# EAGLE design gpio8p5 (EAGLE 7.2.0)
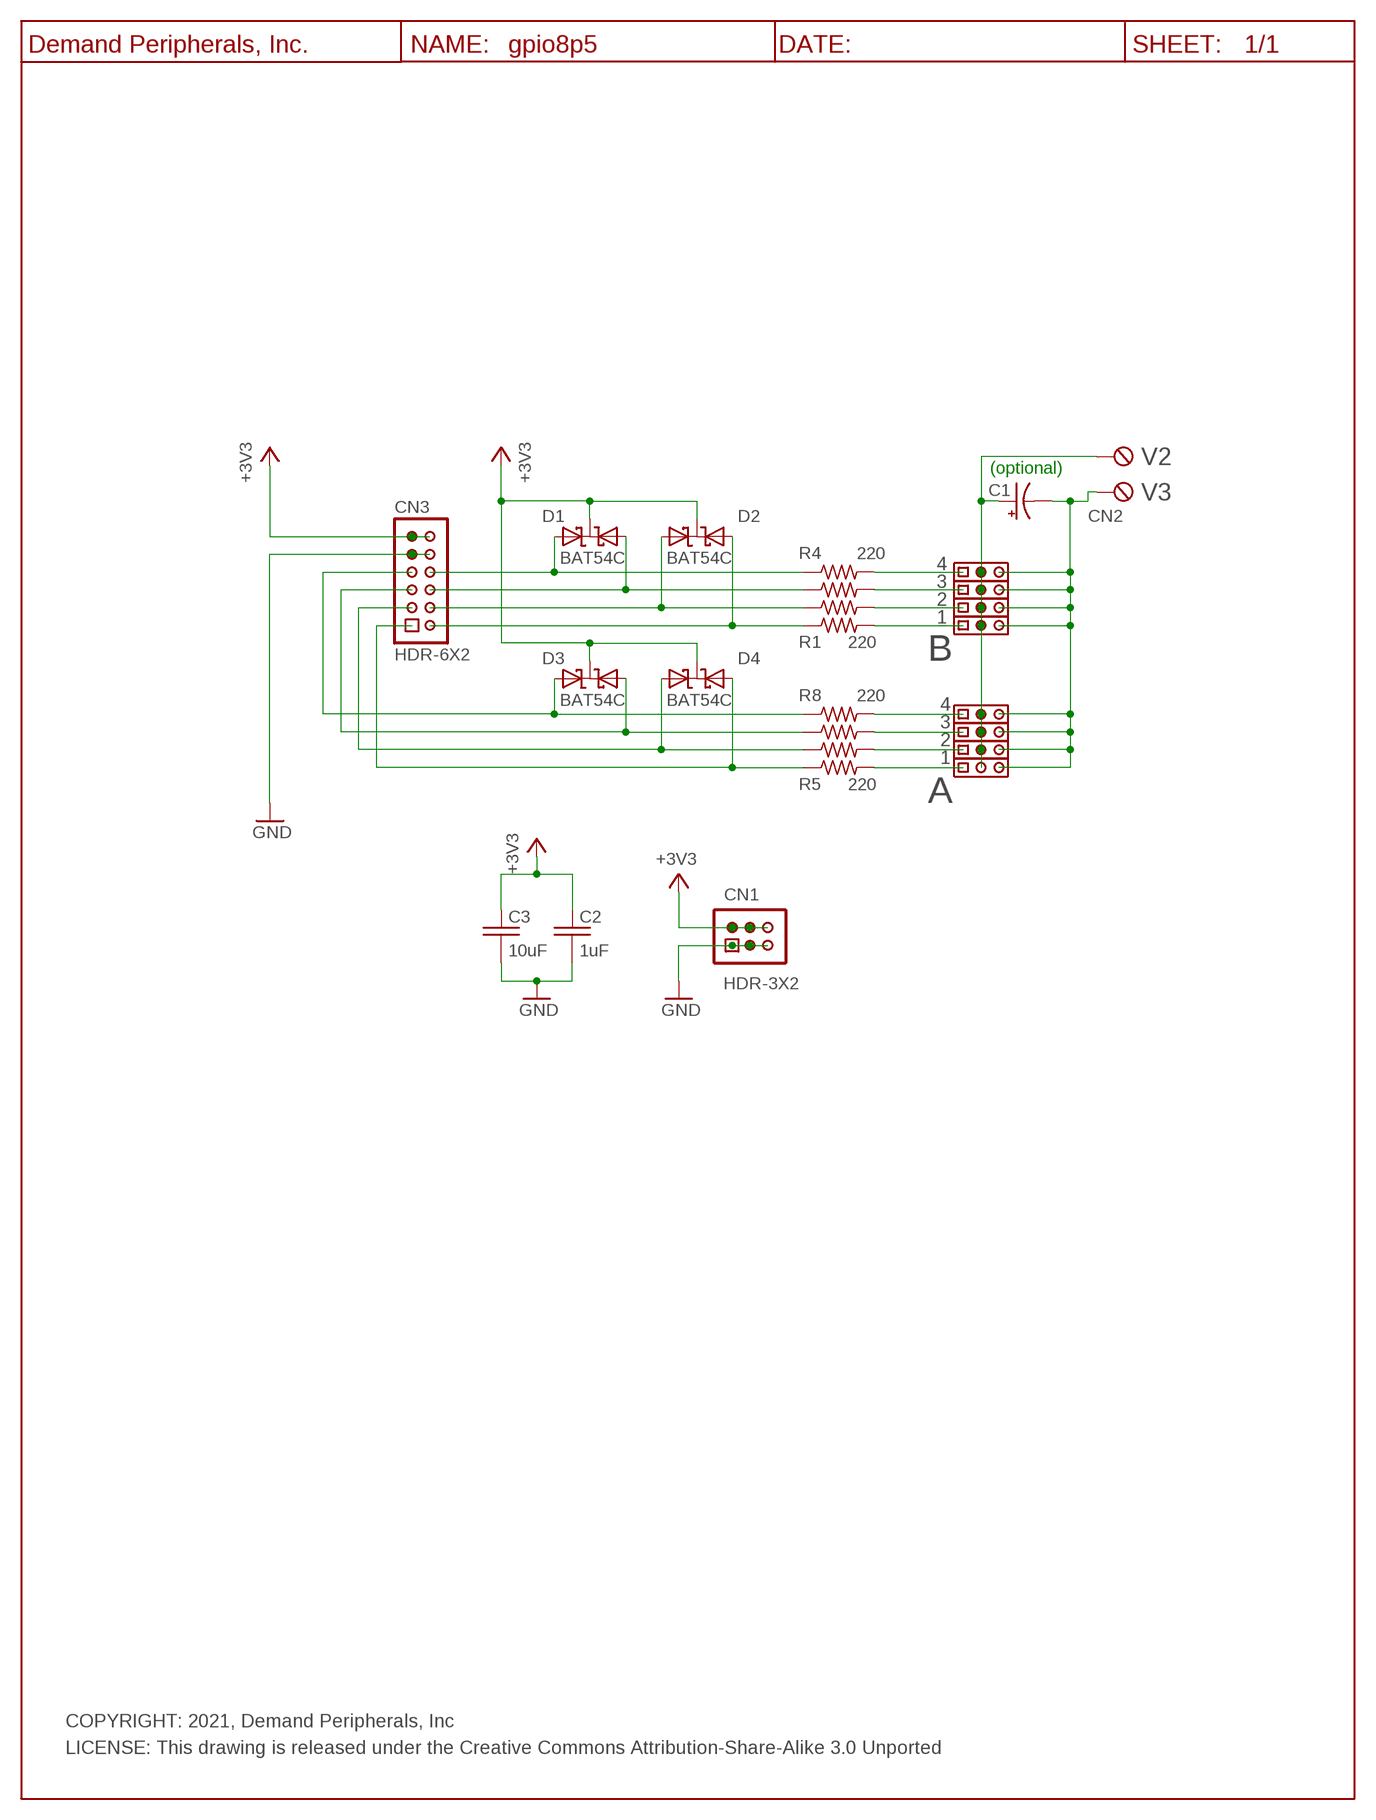
[diagram p0: schematic, sheet 1]

## Parts
C1  100uF  C100UF_E3.5-8  [E3.5-8]
C2  1uF  C1.0UF_C0603  [C0603]
C3  10uF  C10UF25V_C1206  [C1206]
CN1  HDR-3X2  [HDR-3X2]
CN2  TBLK-5.08-X2  [TBLK-5.08-X2]
CN3  HDR-6X2  [HDR-6X2]
D1  BAT54C  [SOT23]
D2  BAT54C  [SOT23]
D3  BAT54C  [SOT23]
D4  BAT54C  [SOT23]
R1  220  R220_R0603  [R0603]
R2  220  R220_R0603  [R0603]
R3  220  R220_R0603  [R0603]
R4  220  R220_R0603  [R0603]
R5  220  R220_R0603  [R0603]
R6  220  R220_R0603  [R0603]
R7  220  R220_R0603  [R0603]
R8  220  R220_R0603  [R0603]
U$1  DP_FRAME_P  [P_FRAME]
U$5  HDR-3X1  [HDR-3X1]
U$6  HDR-3X1  [HDR-3X1]
U$7  HDR-3X1  [HDR-3X1]
U$9  HDR-3X1  [HDR-3X1]
U$10  HDR-3X1  [HDR-3X1]
U$11  HDR-3X1  [HDR-3X1]
U$12  HDR-3X1  [HDR-3X1]
U$13  HDR-3X1  [HDR-3X1]

## Nets
+3V3: C2.1 C3.1 CN1.2 CN1.4 CN1.6 CN3.11 CN3.12 D1.3(CC) D2.3(CC) D3.3(CC) D4.3(CC)
GND: C2.2 C3.2 CN1.1 CN1.3 CN1.5 CN3.9 CN3.10
N$1: R4.2 U$5.1
N$2: R3.2 U$6.1
N$3: R2.2 U$7.1
N$4: R1.2 U$9.1
N$7: C1.- CN2.1(KL) U$5.3 U$6.3 U$7.3 U$9.3 U$10.3 U$11.3 U$12.3 U$13.3
N$8: CN3.7 D3.1(A1) R8.1
N$9: CN3.5 D3.2(A) R7.1
N$10: CN3.3 D4.1(A1) R6.1
N$11: CN3.8 D1.1(A1) R4.1
N$12: CN3.6 D1.2(A) R3.1
N$13: CN3.1 D4.2(A) R5.1
N$14: CN3.4 D2.1(A1) R2.1
N$15: CN3.2 D2.2(A) R1.1
N$16: R8.2 U$10.1
N$17: R7.2 U$11.1
N$18: C1.+ CN2.2(KL1) U$5.2 U$6.2 U$7.2 U$9.2 U$10.2 U$11.2 U$12.2 U$13.2
N$19: R6.2 U$12.1
N$20: R5.2 U$13.1

## Notes on the sheet
- V2
- (optional)
- V3
- 4
- 3
- 2
- 1
- B
- 4
- 3
- 2
- 1
- A
- COPYRIGHT: 2021, Demand Peripherals, Inc
- LICENSE: This drawing is released under the Creative Commons Attribution-Share-Alike 3.0 Unported

## Library data of the parts
C1 = dpi-passive:C100UF_: 100uF polarized capacitor, general purpose; VENDOR: Digikey; VENDOR-PART-NUM: 1572-1044-ND
C2 = dpi-passive:C1.0UF_: 1.0 uF Capacitor, 25V, Y5V; VENDOR: Digikey; VENDOR-PART-NUM: 490-3897-2-ND
C3 = dpi-passive:C10UF25V_: 10 uF Capacitor, 25V, X7R; VENDOR: Digikey; VENDOR-PART-NUM: 1276-1804-2-ND
CN1 = dpi-conn:HDR-3X2: Unshrouded 3x2 header with 0.1 inch pitch; VENDOR: Digikey; VENDOR-PART-NUM: 952-2120-ND
CN2 = dpi-conn:TBLK-5.08-X2: Terminal Block, 5.08mm, x2, screw terminals; VENDOR: Digikey; VENDOR-PART-NUM: ED2609-ND
CN3 = dpi-conn:HDR-6X2: Right angle 6x2 header
D1-D4 = dpi-diopto:BAT54C: BAT54C Dual Common Cathode Schottky; VENDOR: Digikey; VENDOR-PART-NUM: DB3X313N0LCT-ND
R1-R8 = dpi-passive:R220_: 220 Ohm resistor, 1%, 0.1 watt; VENDOR: Digikey; VENDOR-PART-NUM: 311-220HRTR-ND
U$1 = dpi-sym:DP_FRAME_P: Portrait/Letter Document Frame
U$5-U$7 U$9-U$13 = dpi-conn:HDR-3X1: 3 pin header on 0.1 inch centers, no shroud, no lock; VENDOR: Digikey; VENDOR-PART-NUM: 952-2264-ND

## Board
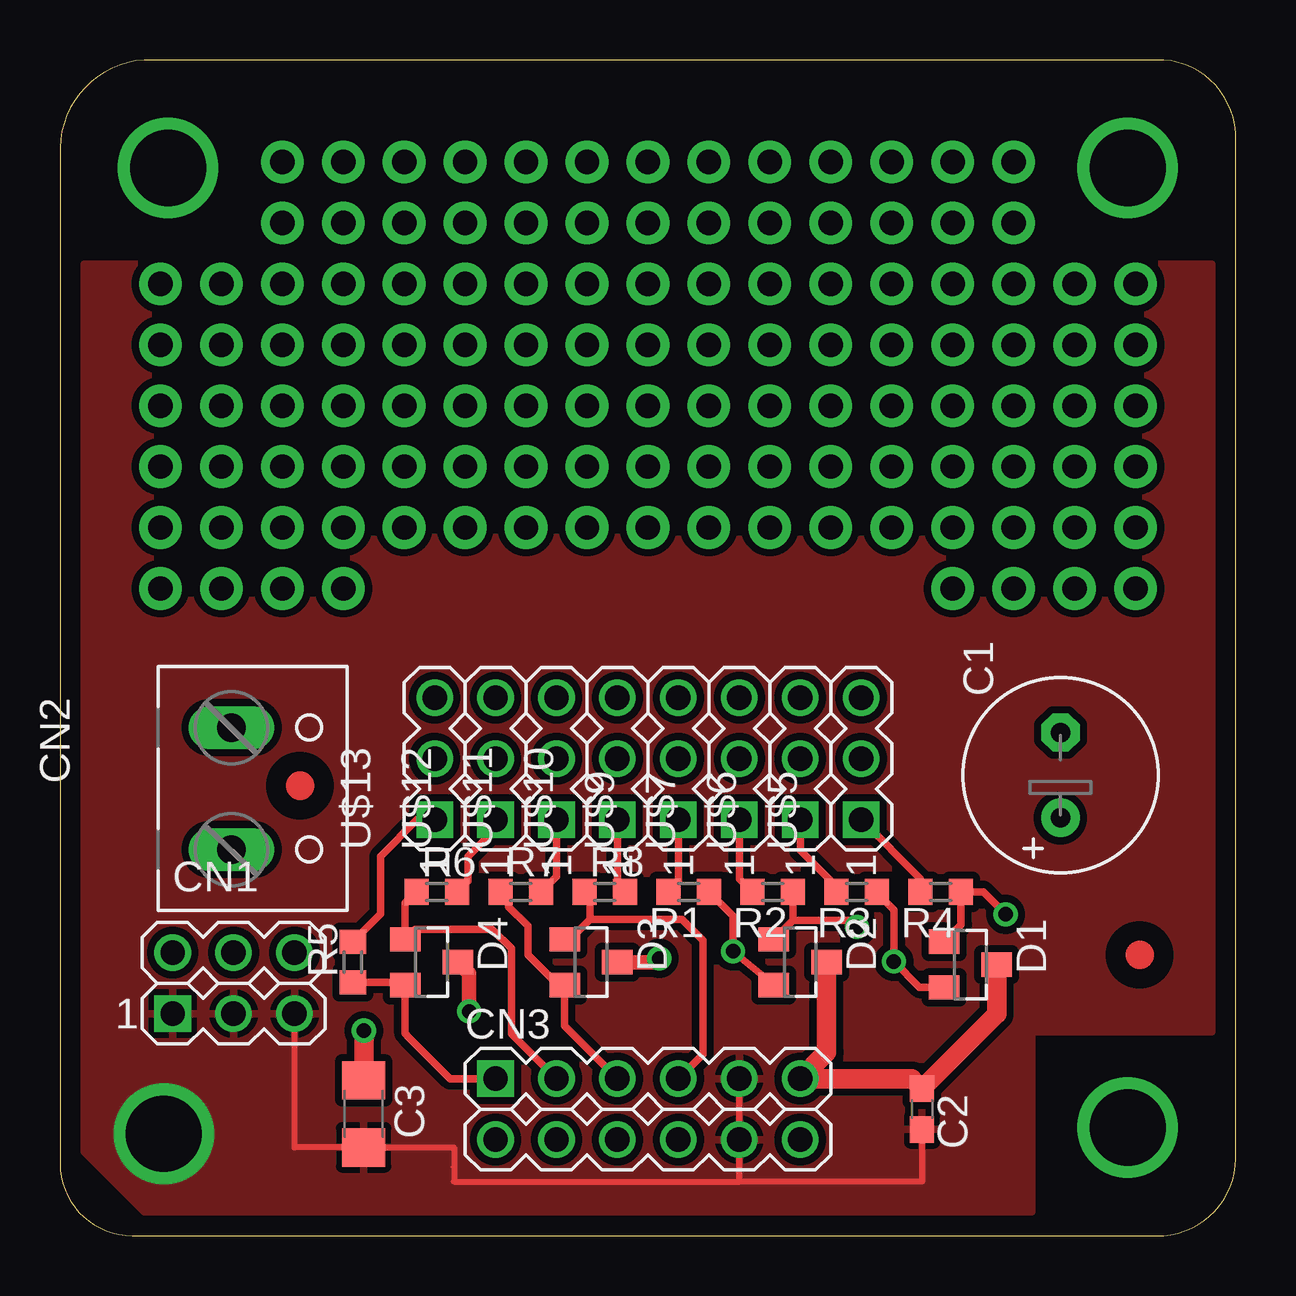
[diagram p1: board, top side]
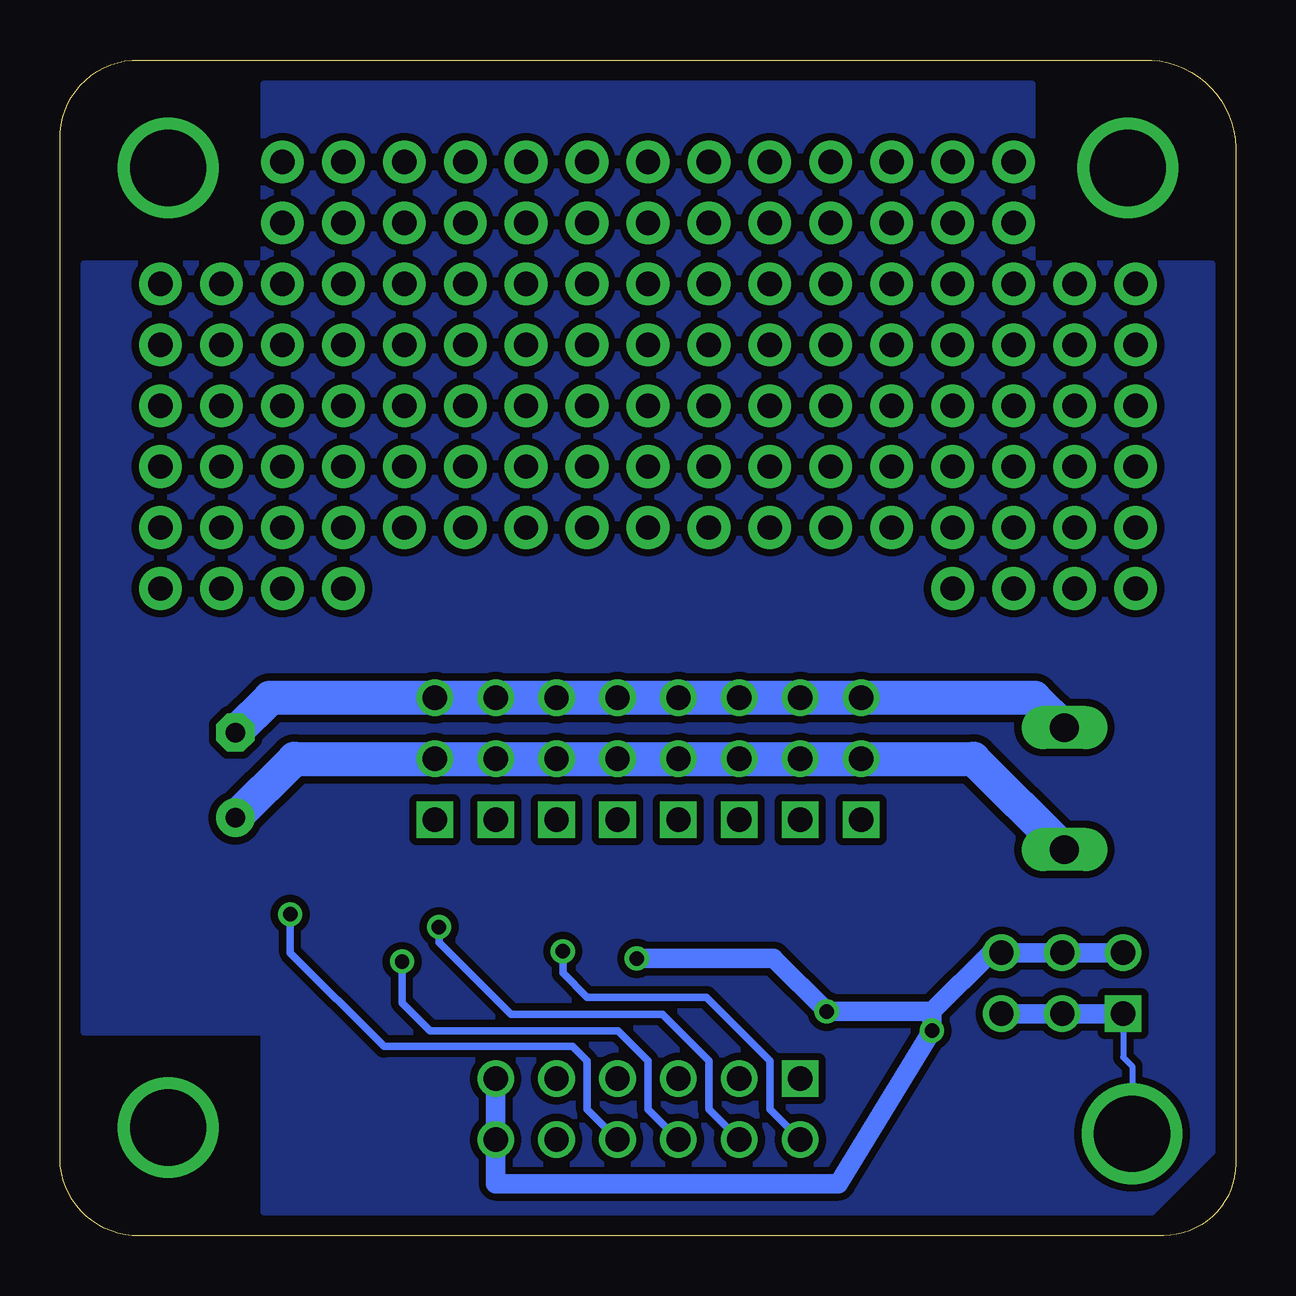
[diagram p2: board, bottom side, seen from below]

Size 49.02 x 49 mm. Coordinates in mm from the lower left corner, seen from the top.
Outline: 49.01,45.5 arc9 49.01,46
Outline: 49.01,46 arc81 46.01,49 3.51,49 arc90 0.01,45 0.01,3 arc90 3.01,0 46.01,0 arc90 49.01,3.5 49.01,46
Copper layers (1*16): Top 0.035mm / dielectric 1.5mm / Bottom 0.035mm
Design rules "default *": minimum track width 10mil, minimum drill 20mil, track to track 12mil, track to pad 12mil, pad to pad 12mil, via to via 12mil, smd to smd 12mil, copper to edge 20mil, drill to drill 8mil, minimum pad ring 10mil, minimum via ring 8mil, stop-mask expansion 4mil, vias tented up to drill 0mil, thermal gap 10mil

### Footprints (pad centres in the part's own frame; a part is rotated, then mirrored left to right if it is on the bottom)
E3.5-8 = drill 0.813 pad 1.6: + -1.778,0 | drill 0.813 pad 1.6 octagon: - 1.778,0
C0603 = smd 1.1 x 1: 1 -0.85,0; 2 0.85,0
C1206 = smd 1.6 x 1.8: 1 -1.4,0; 2 1.4,0
HDR-3X2 = drill 1.016 square: 1 -2.54,-1.27 | drill 1.016: 2 -2.54,1.27; 3 0,-1.27; 4 0,1.27; 5 2.54,-1.27; 6 2.54,1.27
TBLK-5.08-X2 = drill 1.194 long: 1 -2.54,-0.127; 2 2.54,-0.127
HDR-6X2 = drill 1.016 square: 1 1.27,6.35 | drill 1.016: 2 -1.27,6.35; 3 1.27,3.81; 4 -1.27,3.81; 5 1.27,1.27; 6 -1.27,1.27; 7 1.27,-1.27; 8 -1.27,-1.27; 9 1.27,-3.81; 10 -1.27,-3.81; 11 1.27,-6.35; 12 -1.27,-6.35
SOT23 = smd 1.016 x 1.27: 1 -0.95,-1.1; 2 0.95,-1.1; 3 0,1.1
R0603 = smd 1 x 1.1: 1 -0.85,0; 2 0.85,0
HDR-3X1 = drill 1.016 square: 1 -2.54,0 | drill 1.016: 2 0,0; 3 2.54,0

### Placement (x,y rotation side)
C1  41.71,19.19 90 top
C2  35.94,5.27 270 top
C3  12.66,5.07 270 top
CN1  7.24,10.52 0 top
CN2  7.28,18.63 270 top
CN3  24.51,5.27 90 top
D1  37.95,11.29 270 top
D2  30.86,11.39 270 top
D3  22.14,11.39 270 top
D4  15.49,11.39 270 top
R1  26.21,14.32 180 top
R2  29.71,14.32 180 top
R3  33.21,14.32 180 top
R4  36.71,14.32 180 top
R5  12.21,11.4 90 top
R6  15.71,14.32 0 top
R7  19.21,14.32 0 top
R8  22.71,14.32 0 top
U$1  -2.53,-2.54 0 top
U$4  [DPI-2]  5.09,10.16 90 bottom
U$5  33.4,19.88 90 top
U$6  30.86,19.88 90 top
U$7  28.32,19.88 90 top
U$9  25.78,19.88 90 top
U$10  23.24,19.88 90 top
U$11  20.7,19.88 90 top
U$12  18.16,19.88 90 top
U$13  15.62,19.88 90 top
U$14  [FIDUCIAL]  45.01,11.7 0 top
U$15  [FIDUCIAL]  10.01,18.75 0 top
U$16  [DPI-2]  44.98,16.03 90 bottom

### Tracks (layer width: path | path; a pad name or v marks a point on that pad's centre or on a via)
+3V3  (via drill 0.6)
  Top 0.61: v17.06,9.34 17.06,10.93 D4.3 | D3.3 24.82,11.39 v24.98,11.55
  Top 0.813: D1.3 39.05,9.23 C2.1 35.52,6.54 CN3.11 31.96,7.64 D2.3 | C3.1 v12.67,8.54
  Bottom 0.813: 12.67,9.34 v12.67,8.54 16.57,2.16 30.86,2.16 CN3.12 CN3.11 | 12.67,9.34 v17.06,9.34 19.27,11.55 v24.98,11.55 | CN1.2 CN1.4 CN1.6 10.22,11.79 12.67,9.34
GND  (via drill 3.17)
  Top 0.254: CN1.5 9.78,3.67 C3.2 16.42,3.67 16.42,2.86 16.42,2.25 28.32,2.25 | C2.2 35.94,2.25 29.47,2.25 28.32,2.25 | 28.32,2.25 CN3.10 CN3.9
  Bottom 0.254: CN1.1 4.7,7.43 4.51,7.24 4.33,7.06 v4.33,4.24
  Bottom 0.813: CN1.1 CN1.3 CN1.5
  pour Top: 1.01,3.5 1.01,40.5 8.51,40.5 8.51,48 40.51,48 40.51,40.5 48.01,40.5 48.01,8.5 40.51,8.5 40.51,1 3.51,1
GND1
  pour Bottom: 1.01,3.5 1.01,40.5 8.51,40.5 8.51,48 40.51,48 40.51,40.5 48.01,40.5 48.01,8.5 40.51,8.5 40.51,1 3.51,1
MOUNT1  (via drill 3.17 pad 3.17)
  other vias: 44.51,44.5
N$1
  Top 0.305: R4.2 35.86,14.88 U$5.1
N$2
  Top 0.305: R3.2 32.36,14.55 31.01,15.9 30.86,16.05 U$6.1
N$3
  Top 0.305: R2.2 28.32,14.87 U$7.1
N$4
  Top 0.305: R1.2 25.78,14.74 U$9.1
N$7
  Bottom 1.422: CN2.1 8.4,22.41 U$13.3 U$12.3 U$11.3 U$10.3 U$9.3 U$7.3 U$6.3 U$5.3 40.26,22.41 C1.-
N$8
  Top 0.305: CN3.7 26.8,7.56 26.8,12.3 25.92,13.18 22.09,13.18 | 22.09,13.18 21.25,12.35 D3.1 | R8.1 22.09,14.1 22.09,13.18
N$9
  Top 0.305: CN3.5 21.04,8.74 D3.2 20.76,10.45 19.51,11.7 19.51,12.9 18.71,13.7 18.71,13.97 R7.1
N$10
  Top 0.305: CN3.3 19.21,8.03 18.83,8.41 18.83,11.96 18.02,12.77 15.84,12.77 14.81,12.77 D4.1 14.39,13.86 R6.1
N$11  (via drill 0.6)
  Top 0.305: D1.1 37.56,12.96 R4.1 38.48,14.32 v39.42,13.39
  Bottom 0.305: CN3.8 27.05,5.27 27.05,7.28 27.65,7.88 35.51,7.88 39.42,11.79 v39.42,13.39
N$12  (via drill 0.6)
  Top 0.305: 36.83,10.35 D1.2 35.83,10.35 v34.76,11.42 34.76,13.57 34.41,13.93 34.41,13.97 R3.1
  Bottom 0.305: CN3.6 24.51,5.27 24.51,7.29 25.76,8.54 33.6,8.54 34.76,9.7 v34.76,11.42
N$13
  Top 0.305: CN3.1 16.27,6.54 14.56,8.25 14.39,8.42 D4.2 14.28,10.55 R5.1
N$14  (via drill 0.6)
  Top 0.305: D2.1 30.56,13.14 | 30.56,13.14 R2.1 | v33.22,12.86 32.93,13.14 30.56,13.14
  Bottom 0.305: CN3.4 21.97,5.27 21.97,7.29 23.9,9.22 30.22,9.22 33.22,12.22 v33.22,12.86
N$15  (via drill 0.6)
  Top 0.305: D2.2 v28.06,11.85 28.06,13.32 R1.1
  Bottom 0.305: CN3.2 19.43,5.27 19.43,7.29 22.07,9.93 27.05,9.93 28.06,10.94 v28.06,11.85
N$16
  Top 0.305: R8.2 23.24,14.64 U$10.1
N$17
  Top 0.305: R7.2 20.7,14.96 U$11.1
N$18
  Bottom 1.422: C1.+ 39.24,19.88 U$5.2 U$6.2 U$7.2 U$9.2 U$10.2 U$11.2 U$12.2 U$13.2 10.94,19.88 CN2.2
N$19
  Top 0.305: R6.2 17.01,14.78 17.01,15.8 18.16,16.95 U$12.1
N$20
  Top 0.305: U$13.1 14.89,17.34 13.36,15.8 13.36,13.4 R5.2
N$21  (via drill 3.17 pad 3.17)
  other vias: 4.51,44.5
N$22  (via drill 3.17 pad 3.17)
  other vias: 44.51,4.5
WW75  (via drill 1.02 pad 1.78)
  other vias: 4.19,29.51
WW84  (via drill 1.02 pad 1.78)
  other vias: 4.19,32.05
WW85  (via drill 1.02 pad 1.78)
  other vias: 4.19,34.59
WW86  (via drill 1.02 pad 1.78)
  other vias: 4.19,37.13
WW87  (via drill 1.02 pad 1.78)
  other vias: 4.19,39.67
WW97  (via drill 1.02 pad 1.78)
  other vias: 6.73,29.51
WW98  (via drill 1.02 pad 1.78)
  other vias: 6.73,32.05
WW99  (via drill 1.02 pad 1.78)
  other vias: 6.73,34.59
WW108  (via drill 1.02 pad 1.78)
  other vias: 6.73,37.13
WW109  (via drill 1.02 pad 1.78)
  other vias: 6.73,39.67
WW111  (via drill 1.02 pad 1.78)
  other vias: 9.27,29.51
WW120  (via drill 1.02 pad 1.78)
  other vias: 9.27,32.05
WW121  (via drill 1.02 pad 1.78)
  other vias: 9.27,34.59
WW122  (via drill 1.02 pad 1.78)
  other vias: 9.27,37.13
WW123  (via drill 1.02 pad 1.78)
  other vias: 9.27,39.67
WW132  (via drill 1.02 pad 1.78)
  other vias: 9.27,42.21
WW133  (via drill 1.02 pad 1.78)
  other vias: 9.27,44.75
WW135  (via drill 1.02 pad 1.78)
  other vias: 11.81,29.51
WW145  (via drill 1.02 pad 1.78)
  other vias: 11.81,32.05
WW146  (via drill 1.02 pad 1.78)
  other vias: 11.81,34.59
WW156  (via drill 1.02 pad 1.78)
  other vias: 11.81,37.13
WW157  (via drill 1.02 pad 1.78)
  other vias: 11.81,39.67
WW158  (via drill 1.02 pad 1.78)
  other vias: 11.81,42.21
WW159  (via drill 1.02 pad 1.78)
  other vias: 11.81,44.75
WW161  (via drill 1.02 pad 1.78)
  other vias: 14.35,29.51
WW169  (via drill 1.02 pad 1.78)
  other vias: 14.35,32.05
WW171  (via drill 1.02 pad 1.78)
  other vias: 14.35,34.59
WW173  (via drill 1.02 pad 1.78)
  other vias: 14.35,37.13
WW181  (via drill 1.02 pad 1.78)
  other vias: 14.35,39.67
WW182  (via drill 1.02 pad 1.78)
  other vias: 14.35,42.21
WW183  (via drill 1.02 pad 1.78)
  other vias: 14.35,44.75
WW185  (via drill 1.02 pad 1.78)
  other vias: 16.89,29.51
WW190  (via drill 1.02 pad 1.78)
  other vias: 16.89,32.05
WW191  (via drill 1.02 pad 1.78)
  other vias: 16.89,34.59
WW192  (via drill 1.02 pad 1.78)
  other vias: 16.89,37.13
WW193  (via drill 1.02 pad 1.78)
  other vias: 16.89,39.67
WW194  (via drill 1.02 pad 1.78)
  other vias: 16.89,42.21
WW195  (via drill 1.02 pad 1.78)
  other vias: 16.89,44.75
WW197  (via drill 1.02 pad 1.78)
  other vias: 19.43,29.51
WW202  (via drill 1.02 pad 1.78)
  other vias: 19.43,32.05
WW203  (via drill 1.02 pad 1.78)
  other vias: 19.43,34.59
WW204  (via drill 1.02 pad 1.78)
  other vias: 19.43,37.13
WW205  (via drill 1.02 pad 1.78)
  other vias: 19.43,39.67
WW206  (via drill 1.02 pad 1.78)
  other vias: 19.43,42.21
WW207  (via drill 1.02 pad 1.78)
  other vias: 19.43,44.75
WW209  (via drill 1.02 pad 1.78)
  other vias: 21.97,29.51
WW210  (via drill 1.02 pad 1.78)
  other vias: 21.97,32.05
WW211  (via drill 1.02 pad 1.78)
  other vias: 21.97,34.59
WW212  (via drill 1.02 pad 1.78)
  other vias: 21.97,37.13
WW213  (via drill 1.02 pad 1.78)
  other vias: 21.97,39.67
WW214  (via drill 1.02 pad 1.78)
  other vias: 21.97,42.21
WW215  (via drill 1.02 pad 1.78)
  other vias: 21.97,44.75
WW217  (via drill 1.02 pad 1.78)
  other vias: 24.51,29.51
WW218  (via drill 1.02 pad 1.78)
  other vias: 24.51,32.05
WW219  (via drill 1.02 pad 1.78)
  other vias: 24.51,34.59
WW220  (via drill 1.02 pad 1.78)
  other vias: 24.51,37.13
WW221  (via drill 1.02 pad 1.78)
  other vias: 24.51,39.67
WW222  (via drill 1.02 pad 1.78)
  other vias: 24.51,42.21
WW223  (via drill 1.02 pad 1.78)
  other vias: 24.51,44.75
WW225  (via drill 1.02 pad 1.78)
  other vias: 27.05,29.51
WW226  (via drill 1.02 pad 1.78)
  other vias: 27.05,32.05
WW227  (via drill 1.02 pad 1.78)
  other vias: 27.05,34.59
WW228  (via drill 1.02 pad 1.78)
  other vias: 27.05,37.13
WW229  (via drill 1.02 pad 1.78)
  other vias: 27.05,39.67
WW230  (via drill 1.02 pad 1.78)
  other vias: 27.05,42.21
WW231  (via drill 1.02 pad 1.78)
  other vias: 27.05,44.75
WW233  (via drill 1.02 pad 1.78)
  other vias: 29.59,29.51
WW234  (via drill 1.02 pad 1.78)
  other vias: 29.59,32.05
WW235  (via drill 1.02 pad 1.78)
  other vias: 29.59,34.59
WW236  (via drill 1.02 pad 1.78)
  other vias: 29.59,37.13
WW237  (via drill 1.02 pad 1.78)
  other vias: 29.59,39.67
WW238  (via drill 1.02 pad 1.78)
  other vias: 29.59,42.21
WW239  (via drill 1.02 pad 1.78)
  other vias: 29.59,44.75
WW241  (via drill 1.02 pad 1.78)
  other vias: 32.13,29.51
WW242  (via drill 1.02 pad 1.78)
  other vias: 32.13,32.05
WW243  (via drill 1.02 pad 1.78)
  other vias: 32.13,34.59
WW244  (via drill 1.02 pad 1.78)
  other vias: 32.13,37.13
WW245  (via drill 1.02 pad 1.78)
  other vias: 32.13,39.67
WW246  (via drill 1.02 pad 1.78)
  other vias: 32.13,42.21
WW247  (via drill 1.02 pad 1.78)
  other vias: 32.13,44.75
WW249  (via drill 1.02 pad 1.78)
  other vias: 34.67,29.51
WW250  (via drill 1.02 pad 1.78)
  other vias: 34.67,32.05
WW251  (via drill 1.02 pad 1.78)
  other vias: 34.67,34.59
WW252  (via drill 1.02 pad 1.78)
  other vias: 34.67,37.13
WW253  (via drill 1.02 pad 1.78)
  other vias: 34.67,39.67
WW254  (via drill 1.02 pad 1.78)
  other vias: 34.67,42.21
WW255  (via drill 1.02 pad 1.78)
  other vias: 34.67,44.75
WW256  (via drill 1.02 pad 1.78)
  other vias: 37.21,32.05
WW257  (via drill 1.02 pad 1.78)
  other vias: 37.21,34.59
WW258  (via drill 1.02 pad 1.78)
  other vias: 37.21,37.13
WW259  (via drill 1.02 pad 1.78)
  other vias: 37.21,39.67
WW260  (via drill 1.02 pad 1.78)
  other vias: 37.21,42.21
WW261  (via drill 1.02 pad 1.78)
  other vias: 37.21,44.75
WW262  (via drill 1.02 pad 1.78)
  other vias: 39.75,32.05
WW263  (via drill 1.02 pad 1.78)
  other vias: 39.75,34.59
WW264  (via drill 1.02 pad 1.78)
  other vias: 39.75,37.13
WW265  (via drill 1.02 pad 1.78)
  other vias: 39.75,39.67
WW266  (via drill 1.02 pad 1.78)
  other vias: 39.75,42.21
WW267  (via drill 1.02 pad 1.78)
  other vias: 39.75,44.75
WW268  (via drill 1.02 pad 1.78)
  other vias: 42.29,32.05
WW269  (via drill 1.02 pad 1.78)
  other vias: 42.29,34.59
WW270  (via drill 1.02 pad 1.78)
  other vias: 42.29,37.13
WW271  (via drill 1.02 pad 1.78)
  other vias: 42.29,39.67
WW272  (via drill 1.02 pad 1.78)
  other vias: 44.83,32.05
WW273  (via drill 1.02 pad 1.78)
  other vias: 44.83,34.59
WW274  (via drill 1.02 pad 1.78)
  other vias: 44.83,37.13
WW275  (via drill 1.02 pad 1.78)
  other vias: 44.83,39.67
WW277  (via drill 1.02 pad 1.78)
  other vias: 37.21,29.51
WW279  (via drill 1.02 pad 1.78)
  other vias: 39.75,29.51
WW281  (via drill 1.02 pad 1.78)
  other vias: 42.29,29.51
WW283  (via drill 1.02 pad 1.78)
  other vias: 44.83,29.51
WW294  (via drill 1.02 pad 1.78)
  other vias: 4.19,26.97
WW295  (via drill 1.02 pad 1.78)
  other vias: 6.73,26.97
WW296  (via drill 1.02 pad 1.78)
  other vias: 9.27,26.97
WW297  (via drill 1.02 pad 1.78)
  other vias: 11.81,26.97
WW307  (via drill 1.02 pad 1.78)
  other vias: 37.21,26.97
WW308  (via drill 1.02 pad 1.78)
  other vias: 39.75,26.97
WW309  (via drill 1.02 pad 1.78)
  other vias: 42.29,26.97
WW310  (via drill 1.02 pad 1.78)
  other vias: 44.83,26.97

### Text on the board
tTest: 49 mm | 40 mm | GPIO4p5, Rev 21A | A | B | 40 mm | 49 mm | 4 | 3 | 2 | 1 | 4 | 3 | 2 | 1 | V3 | C1 | V2 | R4 | 33 | R5 | R6 | R8 | R1 | R2 | R3 | R7 | Gnd | D3 | D2 | D1 | D4 | CN3 | (C) 2021, Demand Peripherals, Inc. | C3 | C2